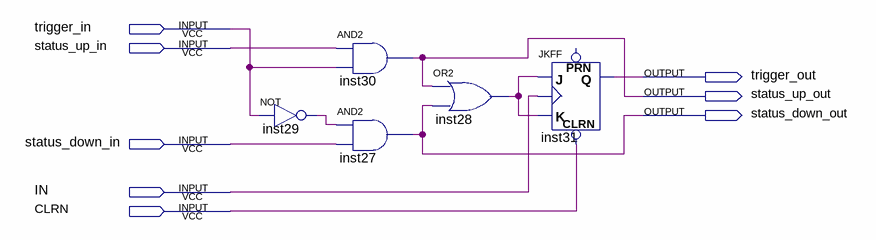
[diagram p0: schematic sheet]
// Quartus schematic myjkff.bdf as structural Verilog: 5 symbols, 8 pins
module myjkff (
  input  trigger_in,
  input  status_up_in,
  input  status_down_in,
  input  IN,
  input  CLRN,
  output trigger_out,
  output status_up_out,
  output status_down_out
);

  wire inst28_out, inst29_out;

  not inst29 (inst29_out, trigger_in);
  and inst30 (status_up_out, status_up_in, trigger_in);
  and inst27 (status_down_out, inst29_out, status_down_in);
  or inst28 (inst28_out, status_up_out, status_down_out);
  JKFF inst31 (.CLRN(CLRN), .K(inst28_out), .J(inst28_out), .CLK(IN), .Q(trigger_out));  // open: PRN
endmodule
